# EAGLE design stromversorgung (EAGLE 9.6.2)
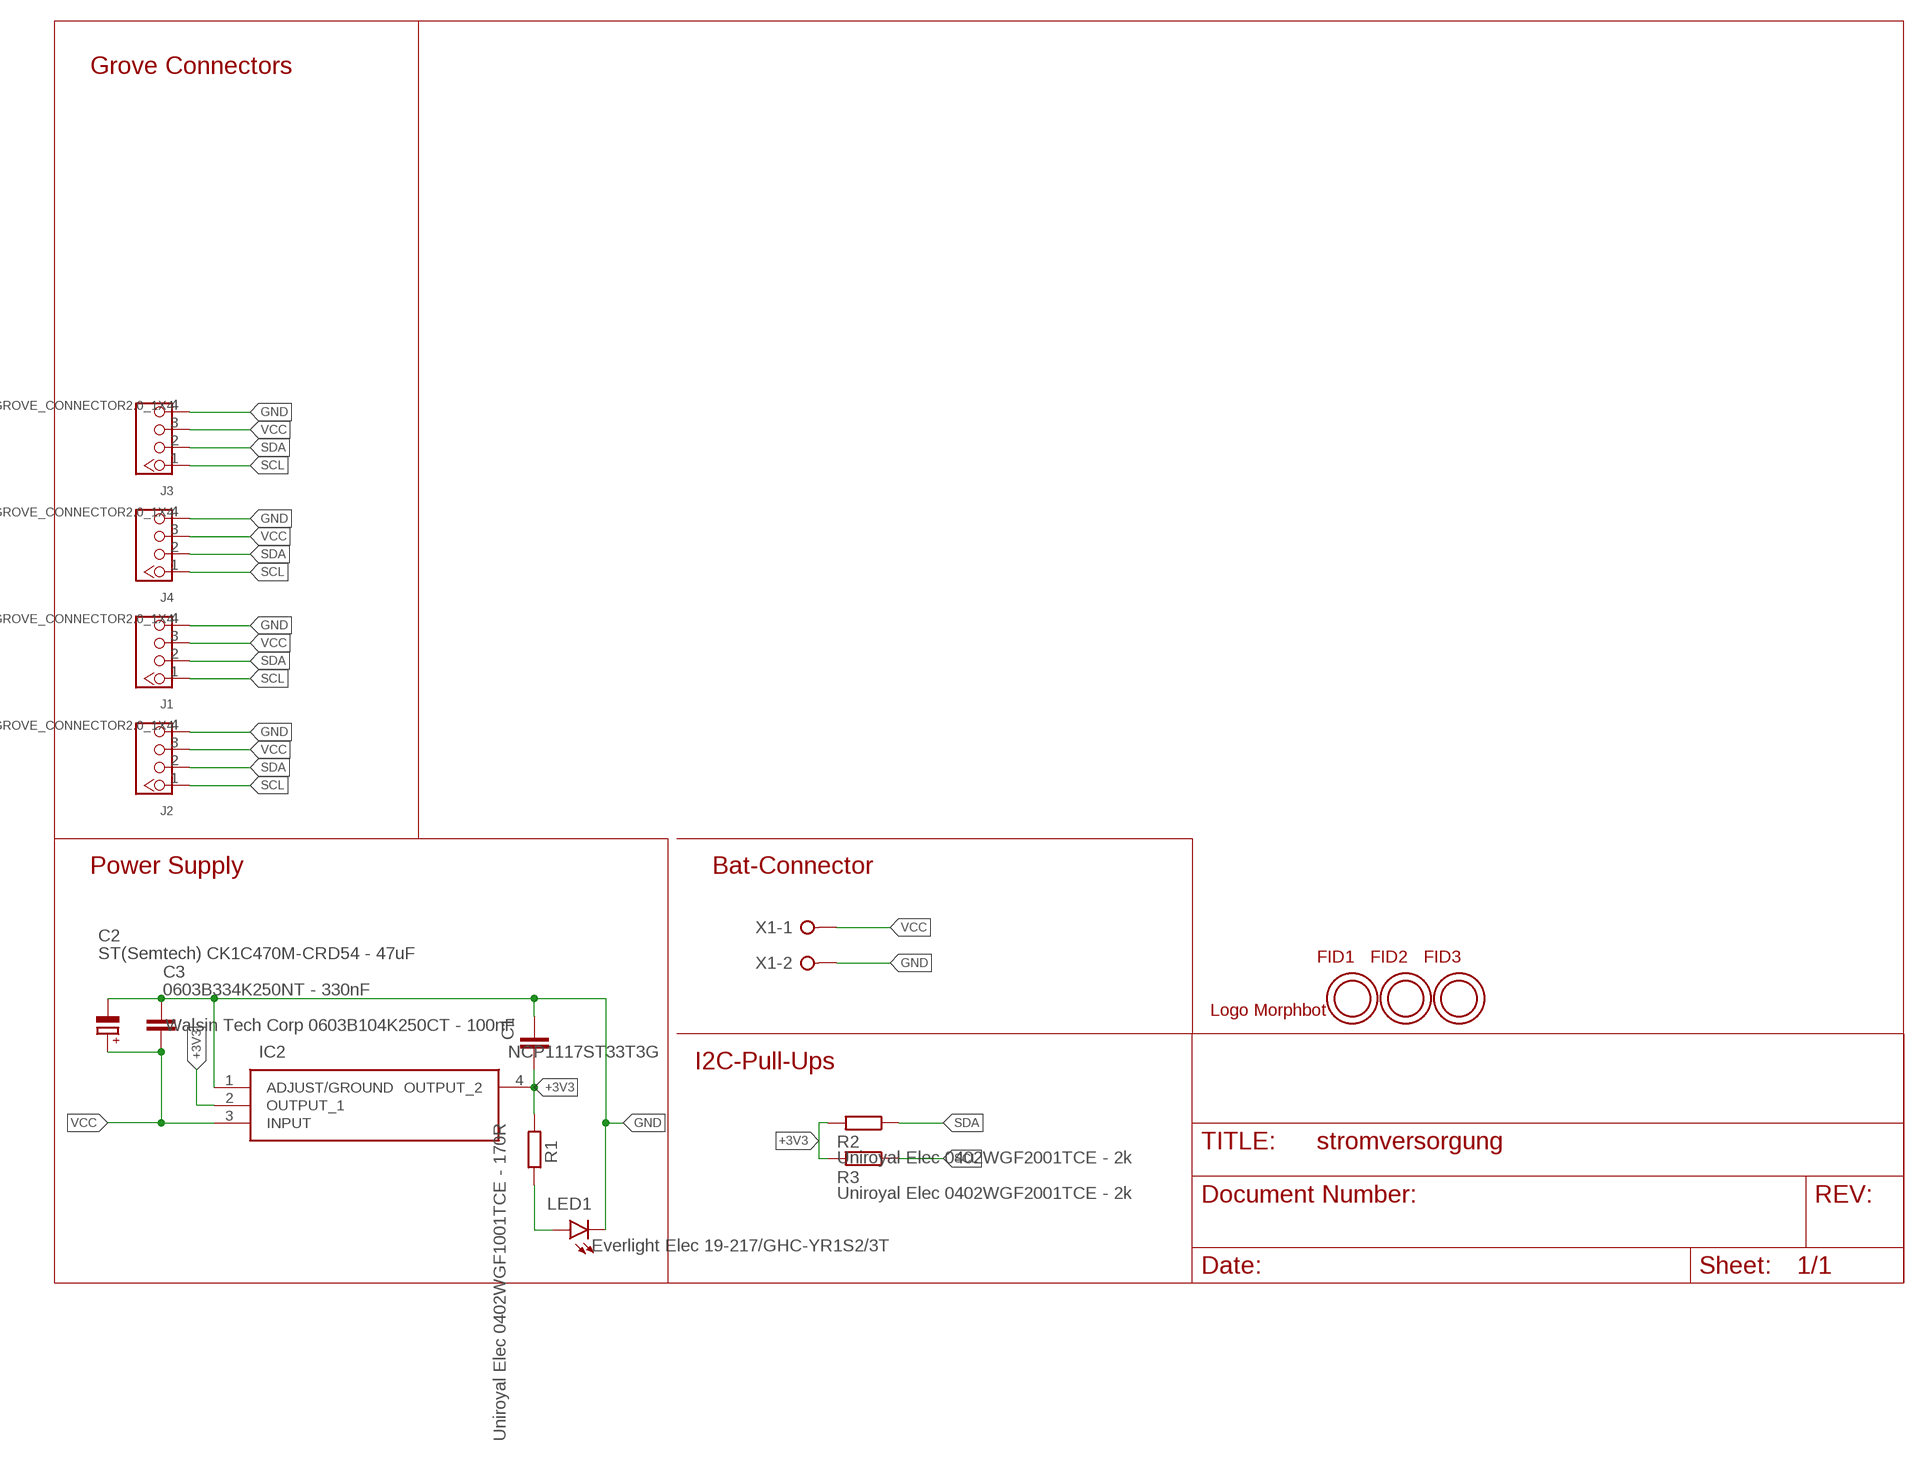
[diagram p0: schematic, sheet 1]

## Parts
C1  Walsin Tech Corp 0603B104K250CT - 100nF  C-EUC0603  [C0603]
C2  ST(Semtech) CK1C470M-CRD54 - 47uF  CPOL-EUC  [PANASONIC_C]
C3  0603B334K250NT - 330nF  C-EUC0603  [C0603]
FID1  OPEN-PNP-FIDUCIAL  [OPEN-PNP-FIDUCIAL]
FID2  OPEN-PNP-FIDUCIAL  [OPEN-PNP-FIDUCIAL]
FID3  OPEN-PNP-FIDUCIAL  [OPEN-PNP-FIDUCIAL]
IC2  NCP1117ST33T3G  [SOT230P700X180-4N]
J1  GROVE_CONNECTOR2.0_1X4  [2.0_1X4_STRAIGHT]
J2  GROVE_CONNECTOR2.0_1X4  [2.0_1X4_STRAIGHT]
J3  GROVE_CONNECTOR2.0_1X4  [2.0_1X4_STRAIGHT]
J4  GROVE_CONNECTOR2.0_1X4  [2.0_1X4_STRAIGHT]
LED1  Everlight Elec 19-217/GHC-YR1S2/3T  LEDCHIPLED_0603  [CHIPLED_0603]
R1  Uniroyal Elec 0402WGF1001TCE - 170R  R-EU_R0402  [R0402]
R2  Uniroyal Elec 0402WGF2001TCE - 2k  R-EU_R0402  [R0402]
R3  Uniroyal Elec 0402WGF2001TCE - 2k  R-EU_R0402  [R0402]
U$1  LOGO_MORPHBOT5MM  [LOGO_MORPHBOT]
X1  W237-02P  [W237-132]

## Nets
+3V3: C1.1 IC2.2(OUTPUT_1) IC2.4(OUTPUT_2) R1.2 R2.2 R3.2
GND: C1.2 C2.- C3.1 IC2.1(ADJUST/GROUND) J1.4 J2.4 J3.4 J4.4 LED1.C X1.2
N$2: LED1.A R1.1
SCL: J1.1 J2.1 J3.1 J4.1 R3.1
SDA: J1.2 J2.2 J3.2 J4.2 R2.1
VCC: C2.+ C3.2 IC2.3(INPUT) J1.3 J2.3 J3.3 J4.3 X1.1

## Notes on the sheet
- Grove Connectors
- Power Supply | Bat-Connector
- I2C-Pull-Ups

## Library data of the parts
C1 C3 = rcl:C-EU: CAPACITOR, European symbol; SPICEPREFIX: C
C2 = rcl:CPOL-EU: POLARIZED CAPACITOR, European symbol; SPICEPREFIX: C
FID1-FID3 = topo-eng:OPEN-PNP-FIDUCIAL
IC2 = samacsys:NCP1117ST33T3G: ON SEMICONDUCTOR - NCP1117ST33T3G - IC, LINEAR VOLTAGE REGULATOR Source: Datasheet <http://www.onsemi.com/pub/Collateral/NCP1117-D.PDF>; ARROW_PART_NUMBER: NCP1117ST33T3G; ARROW_PRICE-STOCK: https://www.arrow.com/en/products/ncp1117st33t3g/on-semiconductor; DESCRIPTION: ON SEMICONDUCTOR - NCP1117ST33T3G - IC, LINEAR VOLTAGE REGULATOR; HEIGHT: 1.8mm; MANUFACTURER_NAME: ON Semiconductor; MANUFACTURER_PART_NUMBER: NCP1117ST33T3G; MOUSER_PART_NUMBER: 863-NCP1117ST33T3G; MOUSER_PRICE-STOCK: https://www.mouser.co.uk/ProductDetail/ON-Semiconductor/NCP1117ST33T3G?qs=Gev%252BmEvV0iZb%2FE8ahUDx3w%3D%3D
J1-J4 = morphbot:GROVE_CONNECTOR: Seeedstudio Grove-Connector: 1 = SCL 2 = SDA 3 = VCC 4 = GND
LED1 = led:LED: LED OSRAM: - CHIPLED LG R971, LG N971, LY N971, LG Q971, LY Q971, LO R971, LY R971 LH N974, LH R974 LS Q976, LO Q976, LY Q976 LO Q996 - Hyper CHIPLED LW Q18S LB Q993, LB Q99A, LB R99A - SideLED LS A670, LO A670, LY A670, LG A670, LP A670 LB A673, LV A673, LT A673, LW A673 LH A674 LY A675 LS A676, LA A676, LO A676, LY A676, LW A676 LS A679, LY A679, LG A679 - Hyper Micro SIDELED® LS Y876, LA Y876, LO Y876, LY Y876 LT Y87S - SmartLED LW L88C, LW L88S LB L89C, LB L89S, LG L890 LS L89K, LO L89K, LY L89K LS L896, LA L896, LO L896, LY L896 - TOPLED LS T670, LO T670, LY T670, LG T670, LP T670 LSG T670, LSP T670, LSY T670, LOP T670, LYG T670 LG T671, LOG T671, LSG T671 LB T673, LV T673, LT T673, LW T673 LH T674 LS T676, LA T676, LO T676, LY T676, LB T676, LH T676, LSB T676, LW T676 LB T67C, LV T67C, LT T67C, LS T67K, LO T67K, LY T67K, LW E67C LS E67B, LA E67B, LO E67B, LY E67B, LB E67C, LV E67C, LT E67C LW T67C LS T679, LY T679, LG T679 LS T770, LO T770, LY T770, LG T770, LP T770 LB T773, LV T773, LT T773, LW T773 LH T774 LS E675, LA E675, LY E675, LS T675 LS T776, LA T776, LO T776, LY T776, LB T776 LHGB T686 LT T68C, LB T68C - Hyper Mini TOPLED® LB M676 - Mini TOPLED Santana® LG M470 LS M47K, LO M47K, LY M47K Source: http://www.osram.convergy.de LUXEON: - LUMILED® LXK2-PW12-R00, LXK2-PW12-S00, LXK2-PW14-U00, LXK2-PW14-V00 LXK2-PM12-R00, LXK2-PM12-S00, LXK2-PM14-U00 LXK2-PE12-Q00, LXK2-PE12-R00, LXK2-PE12-S00, LXK2-PE14-T00, LXK2-PE14-U00 LXK2-PB12-K00, LXK2-PB12-L00, LXK2-PB12-M00, LXK2-PB14-N00, LXK2-PB14-P00, LXK2-PB14-Q00 LXK2-PR12-L00, LXK2-PR12-M00, LXK2-PR14-Q00, LXK2-PR14-R00 LXK2-PD12-Q00, LXK2-PD12-R00, LXK2-PD12-S00 LXK2-PH12-R00, LXK2-PH12-S00 LXK2-PL12-P00, LXK2-PL12-Q00, LXK2-PL12-R00 Source: www.luxeon.com KINGBRIGHT: KA-3528ASYC Source: www.kingbright.com
R1-R3 = rcl:R-EU_: RESISTOR, European symbol; SPICEPREFIX: R
U$1 = topo-eng:LOGO_MORPHBOT
X1 = con-wago-508:W237-02P: WAGO SREW CLAMP; OC_FARNELL: unknown; OC_NEWARK: unknown

## Board
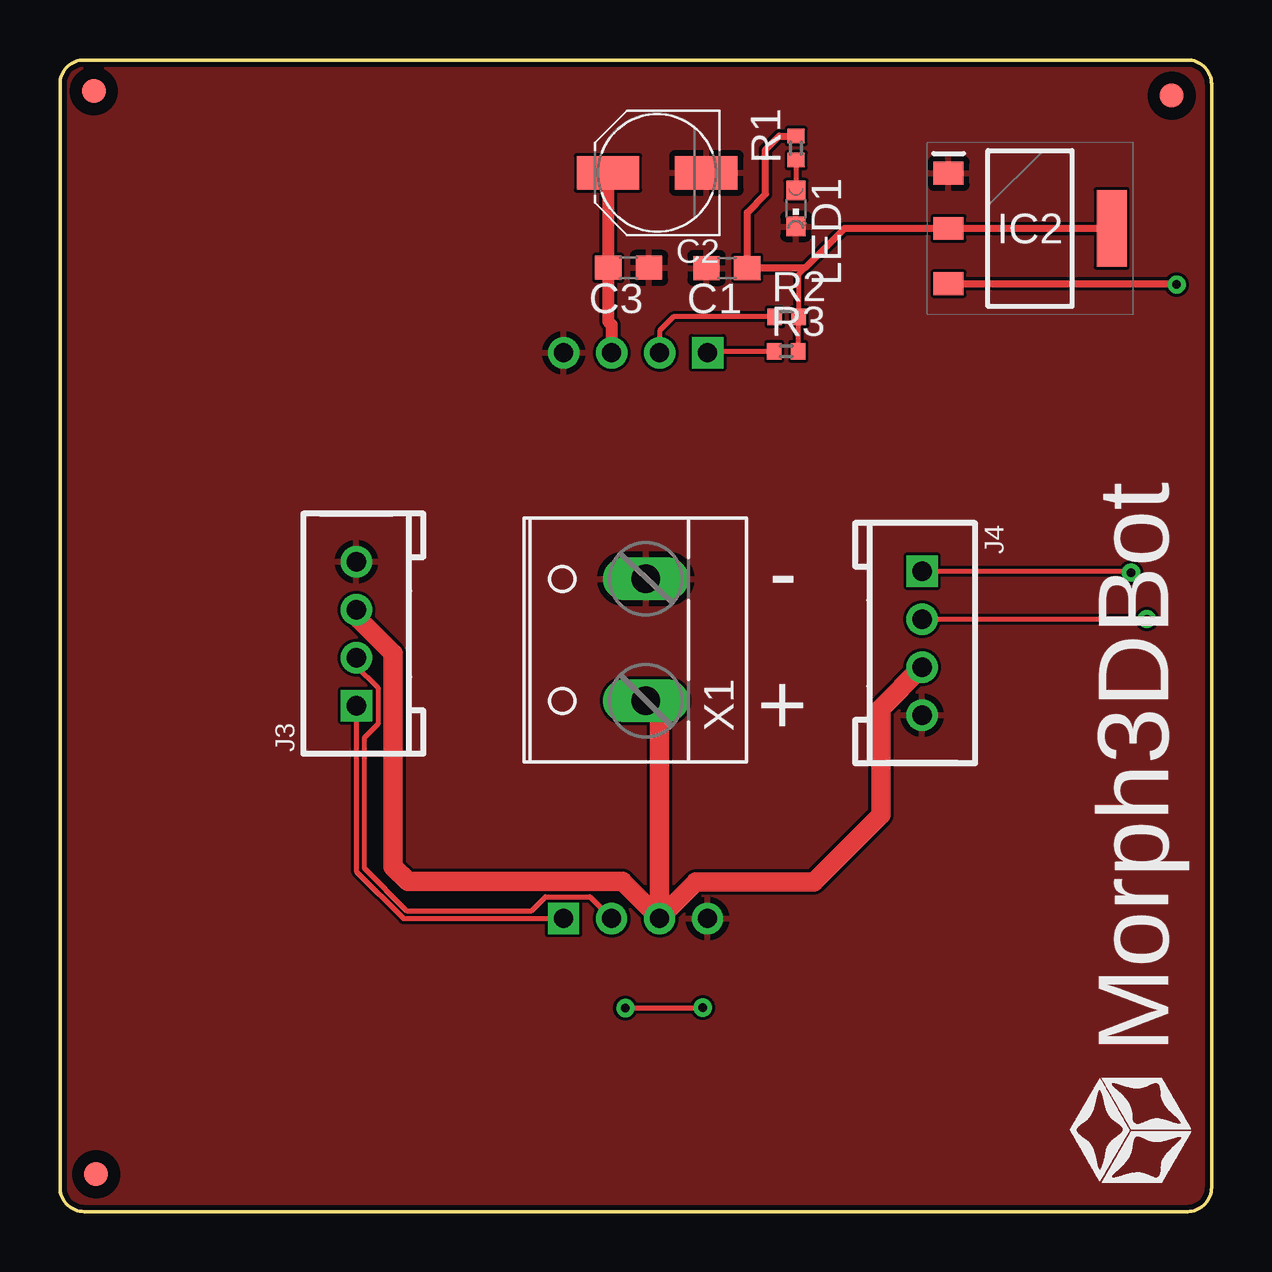
[diagram p1: board, top side]
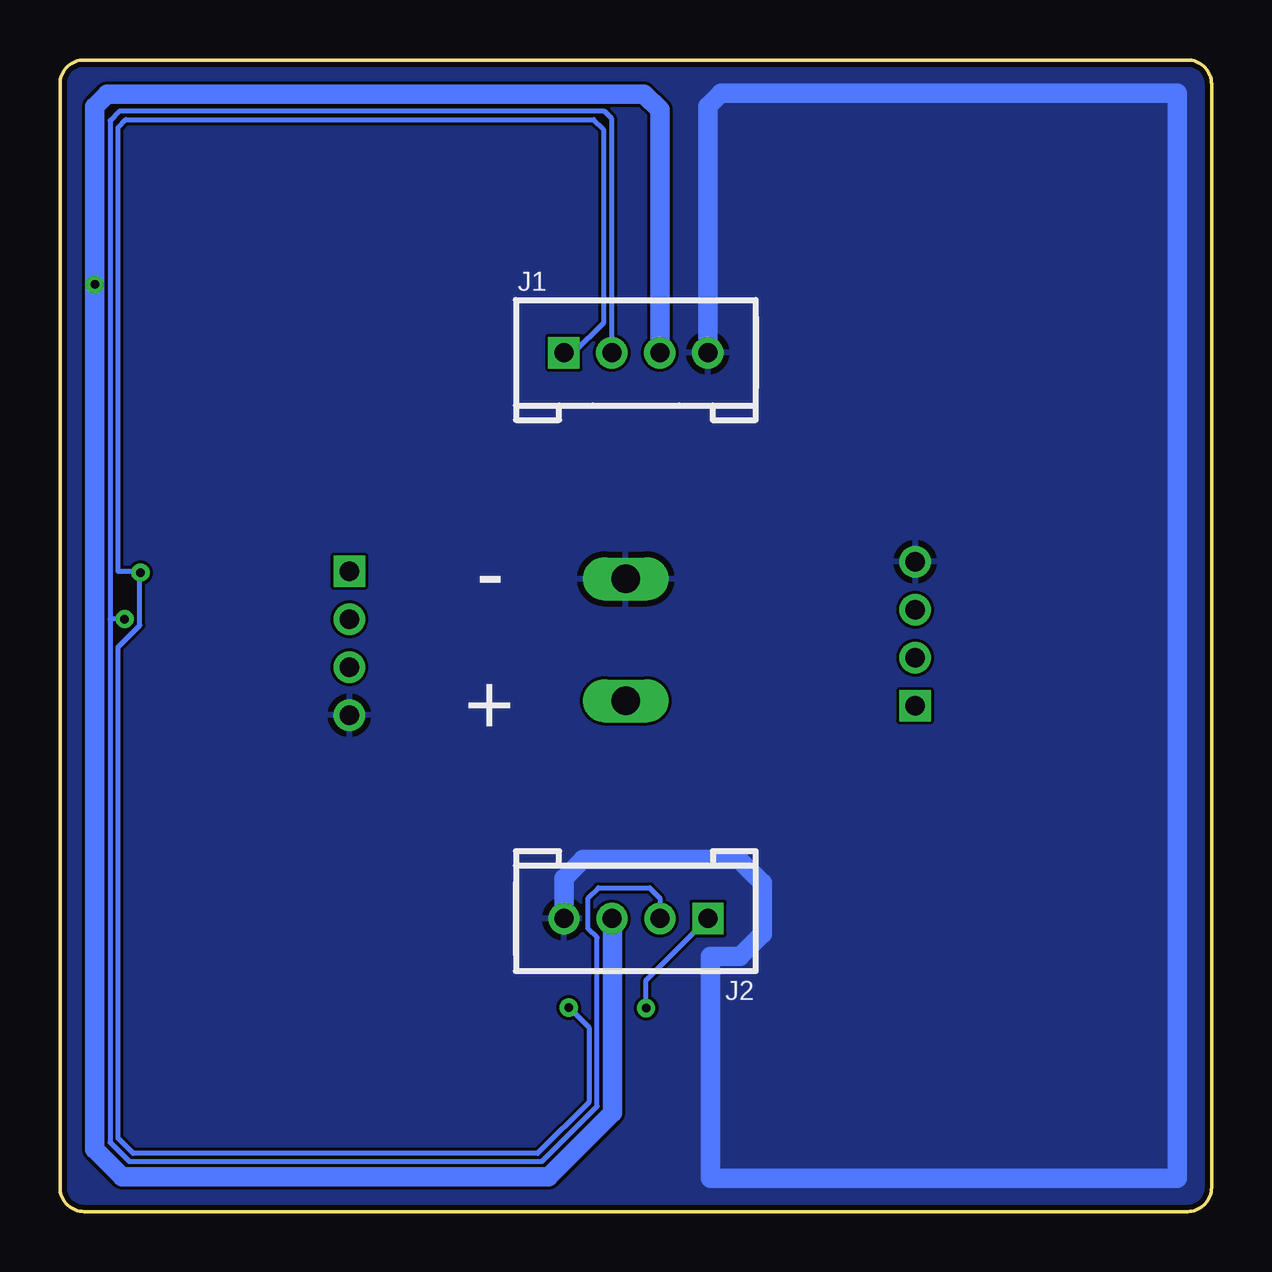
[diagram p2: board, bottom side, seen from below]

Size 48 x 48 mm. Coordinates in mm from the lower left corner, seen from the top.
Outline: 47,0 1,0 arc-90 0,1 0,47 arc-90 1,48 47,48 arc-90 48,47 48,1 arc-90 47,0
Copper layers (1*16): Top 0.035mm / dielectric 0.2mm / Bottom 0.035mm
Design rules "jlcpcb_4_layer *": minimum track width 3.5mil, minimum drill 0.2mm, track to track 5mil, track to pad 6mil, pad to pad 6mil, via to via 6mil, smd to smd 6mil, copper to edge 0.2mm, drill to drill 6mil, minimum pad ring 10mil, minimum via ring 8mil, stop-mask expansion 4mil, vias tented up to drill 0mil, thermal gap 10mil
bKeepout: area 24,0 to 48,48; area 0,0 to 24,48

### Footprints (pad centres in the part's own frame; a part is rotated, then mirrored left to right if it is on the bottom)
C0603 = smd 1.1 x 1: 1 -0.85,0; 2 0.85,0
PANASONIC_C = smd 2.6 x 1.4: + 2.05,0; - -2.05,0
OPEN-PNP-FIDUCIAL = smd 1 x 1: FID$1 0,0
SOT230P700X180-4N = smd 1.25 x 0.95: 1 -3.4,2.3; 2 -3.4,0; 3 -3.4,-2.3 | smd 1.25 x 3.2: 4 3.4,0
2.0_1X4_STRAIGHT = drill 0.8 pad 1.27 square: 1 1.83,-1.786 | drill 0.8 pad 1.27: 2 3.83,-1.786; 3 5.83,-1.786; 4 7.83,-1.786
CHIPLED_0603 = smd 0.8 x 0.8: A 0,-0.75; C 0,0.75
R0402 = smd 0.6 x 0.7: 1 -0.5,0; 2 0.5,0
W237-132 = drill 1.194 long: 1 -2.54,-0.635; 2 2.54,-0.635

### Placement (x,y rotation side)
C1  27.8,39.33 180 top
C2  24.89,43.29 180 top
C3  23.7,39.34 180 top
FID1  1.5,1.56 0 top
FID2  1.41,46.7 0 top
FID3  46.34,46.52 0 top
IC2  40.44,40.98 0 top
J1  28.83,37.58 0 bottom
J2  19.16,10.43 180 bottom
J3  10.57,19.25 90 top
J4  37.72,28.52 270 top
LED1  30.67,41.81 180 top
R1  30.68,44.33 90 top
R2  30.3,37.29 0 top
R3  30.27,35.85 0 top
U$1  47.41,0.64 90 top
X1  23.78,23.83 90 top

### Tracks (layer width: path | path; a pad name or v marks a point on that pad's centre or on a via)
+3V3
  Top 0.2: R3.2 30.77,37.27 R2.2 30.8,39.08 31.04,39.33
  Top 0.3: IC2.4 IC2.2 32.69,40.98 31.04,39.33 C1.1 28.65,41.64 29.41,42.41 29.41,44.27 29.97,44.83 R1.2
GND
  Bottom 0.813: J1.4 21,46.07 20.45,46.61 1.42,46.61 1.42,1.39 20.88,1.39 20.88,10.64 19.65,10.64 18.72,11.57 18.72,13.7 19.7,14.68 26.2,14.68 26.99,13.89 J2.4
  pour Bottom: 1,0 arc-90 0,1 0,47 arc-90 1,48 47,48 arc-90 48,47 48,1 arc-90 47,0
  pour Top: 1,0 arc-90 0,1 0,47 arc-90 1,48 47,48 arc-90 48,47 48,1 arc-90 47,0
N$2
  Top 0.2: R1.1 30.68,42.57 LED1.A
SCL  (via drill 0.35)
  Top 0.2: v26.79,8.5 26.75,8.46 23.59,8.46 v23.57,8.48 | R3.1 27.05,35.85 J1.1 | J4.1 44.59,26.69 v44.65,26.63 | J3.1 12.35,14.18 14.32,12.21 J2.1
  Bottom 0.2: v23.57,8.48 23.57,9.64 J2.1 | v26.79,8.5 25.96,7.67 25.96,4.55 28.08,2.42 44.96,2.42 45.58,3.04 45.58,23.53 44.67,24.43 44.67,26.6 v44.65,26.63 44.7,26.68 45.58,26.68 45.58,45.19 45.25,45.51 25.76,45.51 25.35,45.11 25.35,37.04 26.59,35.8 J1.1
SDA  (via drill 0.35)
  Top 0.2: R2.1 25.57,37.3 25,36.72 J1.2 | J4.2 v45.3,24.69 | J3.2 12.35,22.75 13.26,21.84 13.26,20.33 12.68,19.75 12.68,14.31 14.45,12.54 19.65,12.54 20.23,13.12 22.08,13.12 J2.2
  Bottom 0.2: J1.2 25,45.54 25.31,45.86 45.53,45.86 45.91,45.48 45.91,24.69 | 45.91,24.69 45.91,2.88 45.12,2.09 27.92,2.09 25.61,4.39 25.61,11.42 25.98,11.79 25.98,13.07 25.55,13.49 23.43,13.49 22.99,13.06 J2.2 | v45.3,24.69 45.91,24.69
VCC  (via drill 0.35)
  Top 0.3: IC2.3 46.51,38.67 v46.55,38.64
  Top 0.5: J1.3 23,36.95 22.85,37.1 C3.2 C2.+
  Top 0.813: J3.3 12.35,24.8 13.89,23.26 13.89,14.37 14.51,13.75 23.45,13.75 J2.3 | J4.3 34.21,20.96 34.21,16.53 31.42,13.74 26.52,13.74 J2.3 | X1.1 24.99,20.71 J2.3
  Bottom 0.5: 24.97,12.2 J2.3
  Bottom 0.813: 24.97,12.2 24.97,4.12 27.64,1.45 45.4,1.45 46.55,2.59 v46.55,38.64 46.55,46.05 46.02,46.57 23.65,46.57 23,45.92 J1.3 22.79,35.8

### Text on the board
tNames: - | +
bNames: - | +